# Altium schematic sheet RTU_LMG_Microcontroller.SchDoc
size B; Organization: Altium Limited; Address1: L3, 12a Rodborough Rd; Address2: Frenchs Forest; Address3: NSW; Address4: Australia 2086; SheetNumber: 5; SheetTotal: 16
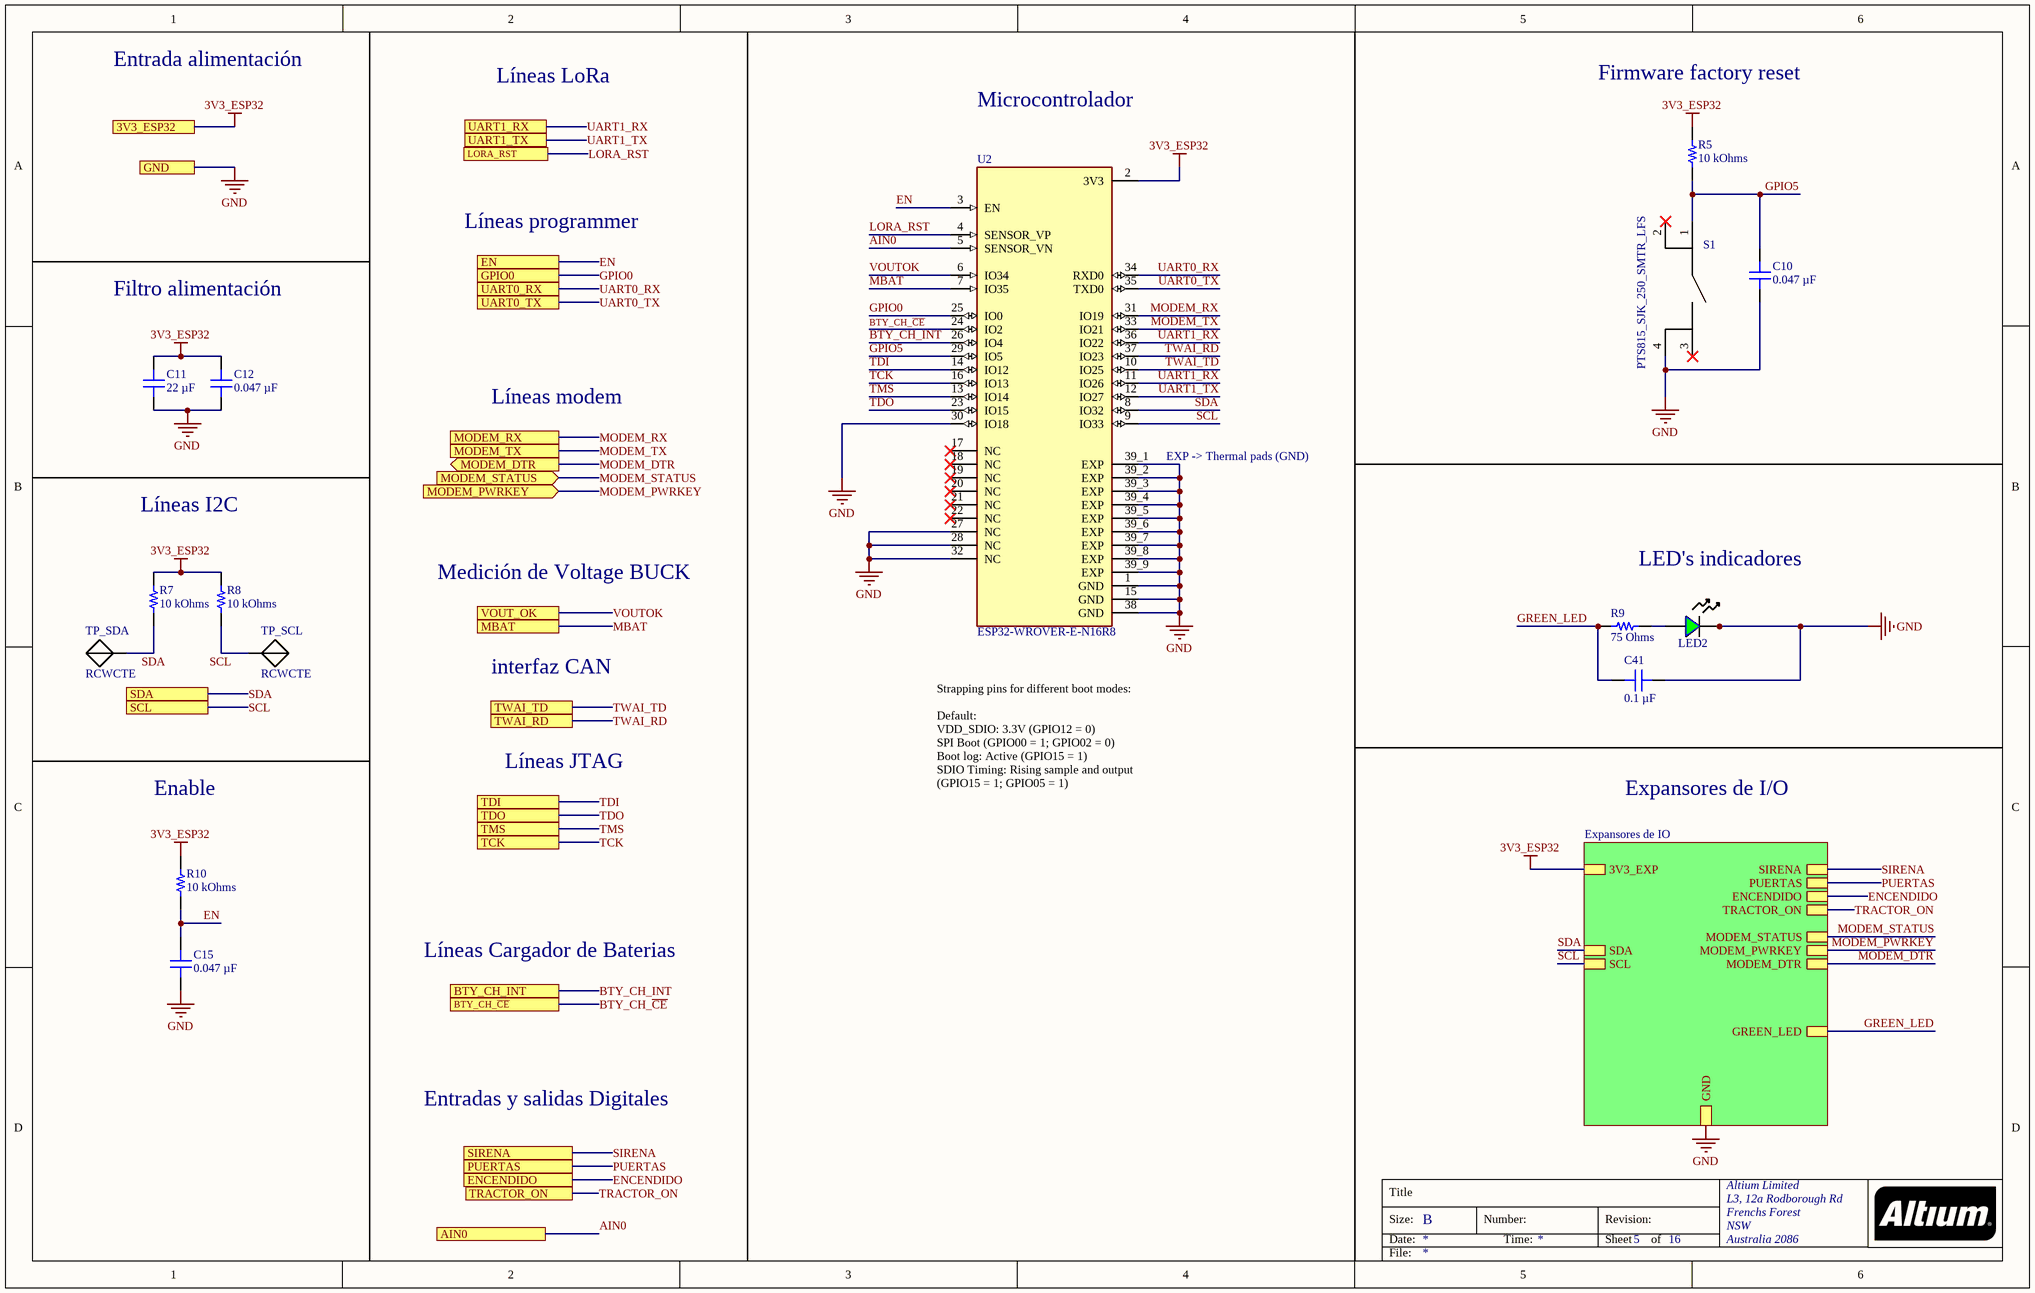
[diagram p0: RTU_LMG_Microcontroller.SchDoc]

## Parts
C10  0.047 µF  [CAP 0603_1608]
C11  22 µF  [CAP 0805_2012]
C12  0.047 µF  [CAP 0603_1608]
C15  0.047 µF  [CAP 0603_1608]
C41  0.1 µF  [CAP 0402_1005]
LED2  LTST-C170GKT  [0805 SMD - LED]  (value not drawn)
R5  10 kOhms  [RES 0603_1608]
R7  10 kOhms  [RES 0603_1608]
R8  10 kOhms  [RES 0603_1608]
R9  75 Ohms  [RES 0402_1005]
R10  10 kOhms  [RES 0603_1608]
S1  PTS815_SJK_250_SMTR_LFS  [PTS815SJK250SMTRLFS]
TP_SCL  RCWCTE  [RCWCTE]
TP_SDA  RCWCTE  [RCWCTE]
U2  ESP32-WROVER-E-N16R8  [ESP32-WROVER-E-N16R8]

## Sub-sheets
Expansores de IO = RTU_LMG_IO_Expanders.SchDoc: GND, MODEM_STATUS, MODEM_PWRKEY, MODEM_DTR, GREEN_LED, SDA, SCL, 3V3_EXP, SIRENA, PUERTAS, ENCENDIDO, TRACTOR_ON

## Ports
3V3_ESP32, AIN0, BTY_CH_INT, BTY_CH_~{CE}, EN, ENCENDIDO, GND, GPIO0, LORA_RST, MBAT, MODEM_DTR (out), MODEM_PWRKEY (in), MODEM_RX, MODEM_STATUS (in), MODEM_TX, PUERTAS, SCL, SDA, SIRENA, TCK, TDI, TDO, TMS, TRACTOR_ON, TWAI_RD, TWAI_TD, UART0_RX, UART0_TX, UART1_RX, UART1_TX, VOUT_OK

## Nets
3V3_ESP32: C11.2 C12.2 R5.2 R7.2 R8.2 R10.2 U2.2(3V3) ; port 3V3_ESP32, sheet Expansores de IO/3V3_EXP
GND: C10.1 C11.1 C12.1 C15.1 C41.1 LED2.K(CATHODE) S1.4(N.O._2) U2.1(GND) U2.15(GND) U2.27(NC) U2.28(NC) U2.30(IO18) U2.32(NC) U2.38(GND) U2.39_1(EXP) U2.39_2(EXP) U2.39_3(EXP) U2.39_4(EXP) U2.39_5(EXP) U2.39_6(EXP) U2.39_7(EXP) U2.39_8(EXP) U2.39_9(EXP) ; port GND, sheet Expansores de IO/GND
AIN0: U2.5(SENSOR_VN) ; port AIN0
BTY_CH_~{CE}: U2.24(IO2) ; port BTY_CH_~{CE}
BTY_CH_INT: U2.26(IO4) ; port BTY_CH_INT
EN: C15.2 R10.1 U2.3(EN) ; port EN
ENCENDIDO: port ENCENDIDO, sheet Expansores de IO/ENCENDIDO
GPIO0: U2.25(IO0) ; port GPIO0
GPIO5: C10.2 R5.1 S1.1(COM_1) U2.29(IO5)
GREEN_LED: C41.2 R9.1 ; sheet Expansores de IO/GREEN_LED
LORA_RST: U2.4(SENSOR_VP) ; port LORA_RST
MBAT: U2.7(IO35) ; port MBAT
MODEM_DTR: port MODEM_DTR, sheet Expansores de IO/MODEM_DTR
MODEM_PWRKEY: port MODEM_PWRKEY, sheet Expansores de IO/MODEM_PWRKEY
MODEM_RX: U2.31(IO19) ; port MODEM_RX
MODEM_STATUS: port MODEM_STATUS, sheet Expansores de IO/MODEM_STATUS
MODEM_TX: U2.33(IO21) ; port MODEM_TX
PUERTAS: port PUERTAS, sheet Expansores de IO/PUERTAS
SCL: R8.1 TP_SCL.1(TP) U2.9(IO33) ; port SCL, sheet Expansores de IO/SCL
SDA: R7.1 TP_SDA.1(TP) U2.8(IO32) ; port SDA, sheet Expansores de IO/SDA
SIRENA: port SIRENA, sheet Expansores de IO/SIRENA
TCK: U2.16(IO13) ; port TCK
TDI: U2.14(IO12) ; port TDI
TDO: U2.23(IO15) ; port TDO
TMS: U2.13(IO14) ; port TMS
TRACTOR_ON: port TRACTOR_ON, sheet Expansores de IO/TRACTOR_ON
TWAI_RD: U2.37(IO23) ; port TWAI_RD
TWAI_TD: U2.10(IO25) ; port TWAI_TD
UART0_RX: U2.34(RXD0) ; port UART0_RX
UART0_TX: U2.35(TXD0) ; port UART0_TX
UART1_RX: U2.11(IO26) U2.36(IO22) ; port UART1_RX
UART1_TX: U2.12(IO27) ; port UART1_TX
VOUTOK: U2.6(IO34) ; port VOUT_OK
NetLED2_A: LED2.A(ANODE) R9.2

Not connected (* = marked no-connect by the designer): S1 2(COM_2)* 3(N.O._1)*; U2 17(NC)* 18(NC)* 19(NC)* 20(NC)* 21(NC)* 22(NC)*

## Notes on the sheet
- Entrada alimentación
- Líneas LoRa
- Firmware factory reset
- Microcontrolador
- Líneas programmer
- Filtro alimentación
- Líneas modem
- EXP -> Thermal pads (GND)
- Líneas I2C
- LED's indicadores
- Medición de Voltage BUCK
- interfaz CAN
- Líneas JTAG
- Enable
- Strapping pins for different boot modes:
  Default:
  VDD_SDIO: 3.3V (GPIO12 = 0)
  SPI Boot (GPIO00 = 1; GPIO02 = 0)
  Boot log: Active (GPIO15 = 1)
  SDIO Timing: Rising sample and output (GPIO15 = 1; GPIO05 = 1)
- Expansores de I/O
- Líneas Cargador de Baterias
- Entradas y salidas Digitales
- Title
- Size:
- Date:
- B
- Number:
- Time:
- Revision:
- Sheet
- of
- File:

## Library data of the parts
C10 C12 C15 = 885012206118: CAP CER 0.047UF 100V X7R 0603; manufacturer: Würth Elektronik; Tolerance: ±10%; Part Number: 885012206118; Value: 0.047 µF; Applications: General Purpose; Capacitance: 0.047 µF; componentlink1description: Datasheet; componentlink1url: https://katalog.we-online.de/pbs/datasheet/885012206118.pdf; componentlink2description: DigiKey Link; componentlink2url: https://www.digikey.com/en/products/detail/würth-elektronik/885012206118/9346004; Device Package: 0603 (1608 Metric); lastupdated: 10/29/2023 7:09:06 PM; Lifecycle Status: Active; Minimum Order: 1; Mounting Type: Surface Mount, MLCC; Operating Temperature: -55°C ~ 125°C; Package / Case: 0603 (1608 Metric); packaging: TapeAndReel; partid: 11891; Part Status: Active; price: 0.06; series: WCAP-CSGP; Size / Dimension: 0.063" L x 0.031" W (1.60mm x 0.80mm); Supplier 1: DigiKey; Supplier Part Number 1: 732-12192-1-ND; Temperature Coefficient: X7R; Thickness (Max): 0.037" (0.95mm); Voltage - Rated: 100V
C11 = CL21A226MOCLRNC: CAP CER 22UF 16V X5R 0805; manufacturer: Samsung Electro-Mechanics; Tolerance: ±20%; Part Number: CL21A226MOCLRNC; Value: 22 µF; Applications: General Purpose; Capacitance: 22 µF; componentlink1description: Datasheet; componentlink1url: http://www.samsungsem.com/kr/support/product-search/mlcc/CL21A226MOCLRNC.jsp; componentlink2description: DigiKey Link; componentlink2url: https://www.digikey.com/en/products/detail/samsung-electro-mechanics/CL21A226MOCLRNC/5961264; Device Package: 0805 (2012 Metric); Features: Low Profile; lastupdated: 10/30/2023 7:14:19 PM; Lifecycle Status: Active; Minimum Order: 1; Mounting Type: Surface Mount, MLCC; Operating Temperature: -55°C ~ 85°C; Package / Case: 0805 (2012 Metric); packaging: TapeAndReel; partid: 4767; Part Status: Active; price: 0.05; series: CL; Size / Dimension: 0.079" L x 0.049" W (2.00mm x 1.25mm); Supplier 1: DigiKey; Supplier Part Number 1: 1276-6780-1-ND; Temperature Coefficient: X5R; Thickness (Max): 0.037" (0.95mm); Voltage - Rated: 16V
C41 = CGA2B3X5R1H104M050BB: CAP CER 0.1UF 50V X5R 0402; manufacturer: TDK Corporation; Tolerance: ±20%; Part Number: CGA2B3X5R1H104M050BB; Capacitance: 0.1 µF; Applications: Automotive; componentlink1description: Datasheet; componentlink1url: https://product.tdk.com/info/en/catalog/datasheets/mlcc_automotive_general_en.pdf?ref_disty=digikey; componentlink2description: DigiKey Link; componentlink2url: https://www.digikey.com/en/products/detail/tdk-corporation/CGA2B3X5R1H104M050BB/3949450; Device Package: 0402 (1005 Metric); lastupdated: 9/2/2024 20:04:38; Lifecycle Status: Active; Minimum Order: 1; Mounting Type: Surface Mount, MLCC; Operating Temperature: -55°C ~ 85°C; Package / Case: 0402 (1005 Metric); packaging: TapeAndReel; partid: 1792; Part Status: Active; price: 0.01; Ratings: AEC-Q200; series: CGA; Size / Dimension: 0.039" L x 0.020" W (1.00mm x 0.50mm); Supplier 1: DigiKey; Supplier Part Number 1: 445-12214-1-ND; Temperature Coefficient: X5R; Thickness (Max): 0.022" (0.55mm); value: 0.1 µF; Voltage - Rated: 50V
LED2 = LTST-C170GKT: LED verde SMD (0805); Mfr_Name: Wolfspeed; Type: DEV; Copyright: Copyright (C) 2023 Ultra Librarian. All rights reserved.; Manufacturer_Part_Number: LTST-C170GKT; RefDes: RefDes
R5 R7 R8 R10 = RC0603FR-0710KL: RES 10K OHM 1% 1/10W 0603; Manufacturer: Yageo; Power (Watts): 0.1W, 1/10W; Temperature Coefficient: ±100ppm/°C; Part Number: RC0603FR-0710KL; Value: 10 kOhms; ComponentLink1Description: Datasheet; ComponentLink1URL: https://www.yageo.com/upload/media/product/productsearch/datasheet/rchip/PYu-RC_Group_51_RoHS_L_10.pdf; ComponentLink2Description: DigiKey Link; ComponentLink2URL: https://www.digikey.com/en/products/detail/yageo/RC0603FR-0710KL/726880; Composition: Thick Film; Device Package: 0603 (1608 Metric); Features: Moisture Resistant; Height - Seated (Max): 0.022" (0.55mm); LastUpdated: 10/30/2023 7:36:43 PM; Lifecycle Status: Active; Minimum Order: 1; Number of Terminations: 2; Operating Temperature: -55°C ~ 155°C; Package / Case: 0603 (1608 Metric); Packaging: CutTape; PartId: 22599; Part Status: Active; Price: 0.01; Resistance: 10 kOhms; Series: RC_L; Size / Dimension: 0.063" L x 0.031" W (1.60mm x 0.80mm); Supplier 1: DigiKey; Supplier Part Number 1: 311-10.0KHRCT-ND; Supplier Device Package: 0603; Tolerance: ±1%
R9 = CRCW040275R0FKEDC: RES 75 OHM 1% 1/16W 0402; Manufacturer: Vishay Dale; Power (Watts): 0.063W, 1/16W; Temperature Coefficient: ±100ppm/°C; Part Number: CRCW040275R0FKEDC; Value: 75 Ohms; ComponentLink1Description: Datasheet; ComponentLink1URL: http://www.vishay.com/docs/28773/crcwce3.pdf; ComponentLink2Description: DigiKey Link; ComponentLink2URL: https://www.digikey.com/en/products/detail/vishay-dale/CRCW040275R0FKEDC/7928421; Composition: Thick Film; Device Package: 0402 (1005 Metric); Height - Seated (Max): 0.014" (0.35mm); LastUpdated: 11/3/2023 7:28:02 PM; Lifecycle Status: Active; Minimum Order: 1; Number of Terminations: 2; Operating Temperature: -55°C ~ 155°C; Package / Case: 0402 (1005 Metric); Packaging: CutTape; PartId: 16117; Part Status: Active; Price: 0.01; Resistance: 75 Ohms; Series: CRCW-C; Size / Dimension: 0.039" L x 0.020" W (1.00mm x 0.50mm); Supplier 1: DigiKey; Supplier Part Number 1: 541-3999-1-ND; Supplier Device Package: 0402; Tolerance: ±1%
S1 = PTS815_SJK_250_SMTR_LFS: Switch; Manufacturer_Name: C & K COMPONENTS; Manufacturer_Part_Number: PTS815 SJK 250 SMTR LFS; Datasheet Link: https://www.mouser.com/datasheet/2/60/pts815-1535658.pdf; Height: 2mm; Mouser Part Number: 611-PTS815SJK250SMTR; Mouser Price/Stock: https://www.mouser.co.uk/ProductDetail/CK/PTS815-SJK-250-SMTR-LFS?qs=ahcBuItHZ3yETpGYMHf%2FgQ%3D%3D; Arrow Part Number: PTS815 SJK 250 SMTR LFS; Arrow Price/Stock: https://www.arrow.com/en/products/pts815-sjk-250-smtr-lfs/ck
TP_SCL TP_SDA = RCWCTE: - PC Test Point - - Plating Surface Mount Mounting Type; MF: KOA Speer; Check_prices: https://www.snapeda.com/parts/RCWCTE/KOA+Speer/view-part/?ref=eda; SnapEDA_Link: https://www.snapeda.com/parts/RCWCTE/KOA+Speer/view-part/?ref=snap; Digi-Key_Part_Number: 2019-RCWCTETR-ND; Value: *; Purchase-URL: https://pricing.snapeda.com/search/part/RCWCTE/?ref=eda; Package: None; MP: RCWCTE
U2 = ESP32-WROVER-E-N16R8: Bluetooth, WiFi 802.11b/g/n, Bluetooth v4.2 +EDR Transceiver Module 2.4GHz ~ 2.5GHz PCB Trace Surface Mount